# EAGLE design top (EAGLE 9.6.2)
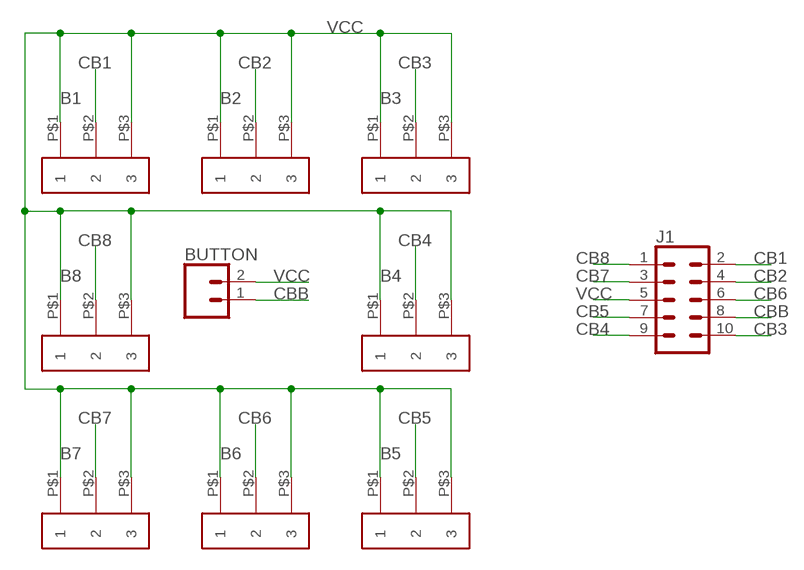
[diagram p0: schematic, sheet 1]

## Parts
B1  BOCAL  [BOCAL]
B2  BOCAL  [BOCAL]
B3  BOCAL  [BOCAL]
B4  BOCAL  [BOCAL]
B5  BOCAL  [BOCAL]
B6  BOCAL  [BOCAL]
B7  BOCAL  [BOCAL]
B8  BOCAL  [BOCAL]
BUTTON  CONN_02  [1X02]
J1  CONN_05X2NO_SILK  [2X5_NOSILK]

## Nets
CB1: B1.P$2 J1.2
CB2: B2.P$2 J1.4
CB3: B3.P$2 J1.10
CB4: B4.P$2 J1.9
CB5: B5.P$2 J1.7
CB6: B6.P$2 J1.6
CB7: B7.P$2 J1.3
CB8: B8.P$2 J1.1
CBB: BUTTON.1 J1.8
VCC: B1.P$1 B1.P$3 B2.P$1 B2.P$3 B3.P$1 B3.P$3 B4.P$1 B4.P$3 B5.P$1 B5.P$3 B6.P$1 B6.P$3 B7.P$1 B7.P$3 B8.P$1 B8.P$3 BUTTON.2 J1.5

## Library data of the parts
B1-B8 = myLib:BOCAL: Defines a base connector for Tampi.
BUTTON = SparkFun-Connectors:CONN_02: Multi connection point. Often used as Generic Header-pin footprint for 0.1 inch spaced/style header connections On any of the 0.1 inch spaced packages, you can populate with these: Break Away Headers - Straight <https://www.sparkfun.com/products/116> (PRT-00116) Break Away Male Headers - Right Angle <https://www.sparkfun.com/products/553> (PRT-00553) Female Headers <https://www.sparkfun.com/products/115> (PRT-00115) Break Away Headers - Machine Pin <https://www.sparkfun.com/products/117> (PRT-00117) Break Away Female Headers - Swiss Machine Pin <https://www.sparkfun.com/products/743> (PRT-00743) For SCREWTERMINALS and SPRING TERMINALS visit here: Screw Terimnals on SparkFun.com <https://www.sparkfun.com/search/results?term=Screw+Terminals> (5mm/3.5mm/2.54mm spacing) This device is also useful as a general connection point to wire up your design to another part of your project. Our various solder wires solder well into these plated through hole pads. Hook-Up Wire - Assortment (Stranded, 22 AWG) <https://www.sparkfun.com/products/11375> (PRT-11375) Hook-Up Wire - Assortment (Solid Core, 22 AWG) <https://www.sparkfun.com/products/11367> (PRT-11367) View the entire wire category on our website here <https://www.sparkfun.com/categories/141> Special notes: Molex polarized connector foot print use with: PRT-08233 with associated crimp pins and housings. 2.54_SCREWTERM for use with PRT-10571. 3.5mm Screw Terminal footprints for PRT-08084 5mm Screw Terminal footprints for use with PRT-08432
J1 = SparkFun-Connectors:CONN_05X2: Multi connection point. Often used as Generic Header-pin footprint for 0.1 inch spaced/style header connections For AVR SPI programming port, see special device with nice symbol: "AVR_SPI_PROG_5x2.dev" You can populate with any combo of single row headers, but if you'd like an exact match, check these: 2x5 AVR ICSP Male Header <https://www.sparkfun.com/products/778> (PRT-00778) 2x5 Pin Shrouded Header <https://www.sparkfun.com/products/8506> (PRT-08506) On any of the 0.1 inch spaced packages, you can populate with these: Break Away Headers - Straight <https://www.sparkfun.com/products/116> (PRT-00116) Break Away Male Headers - Right Angle <https://www.sparkfun.com/products/553> (PRT-00553) Female Headers <https://www.sparkfun.com/products/115> (PRT-00115) Break Away Headers - Machine Pin <https://www.sparkfun.com/products/117> (PRT-00117) Break Away Female Headers - Swiss Machine Pin <https://www.sparkfun.com/products/743> (PRT-00743) Special note: the shrouded connector mates well with our 5x2 ribbon cables: 2x5 Pin IDC Ribbon Cable <https://www.sparkfun.com/products/8535> (PRT-08535)

## Board
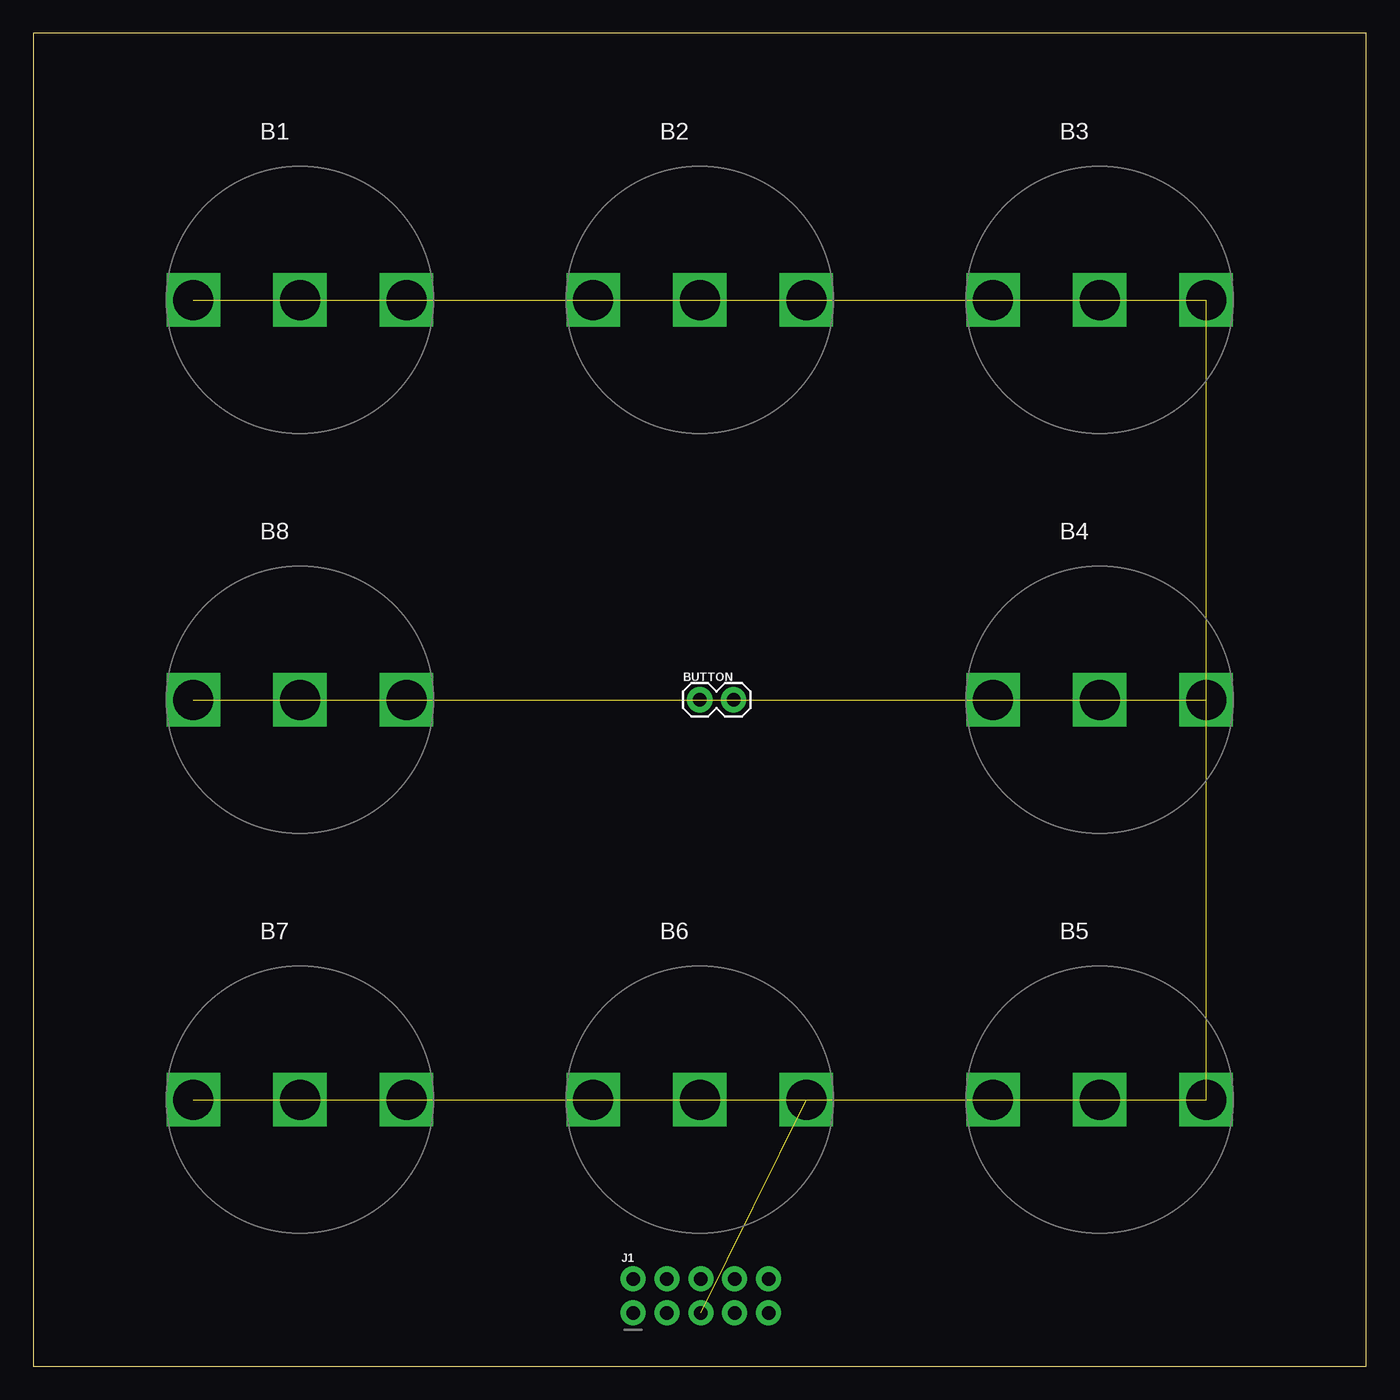
[diagram p1: board, top side]
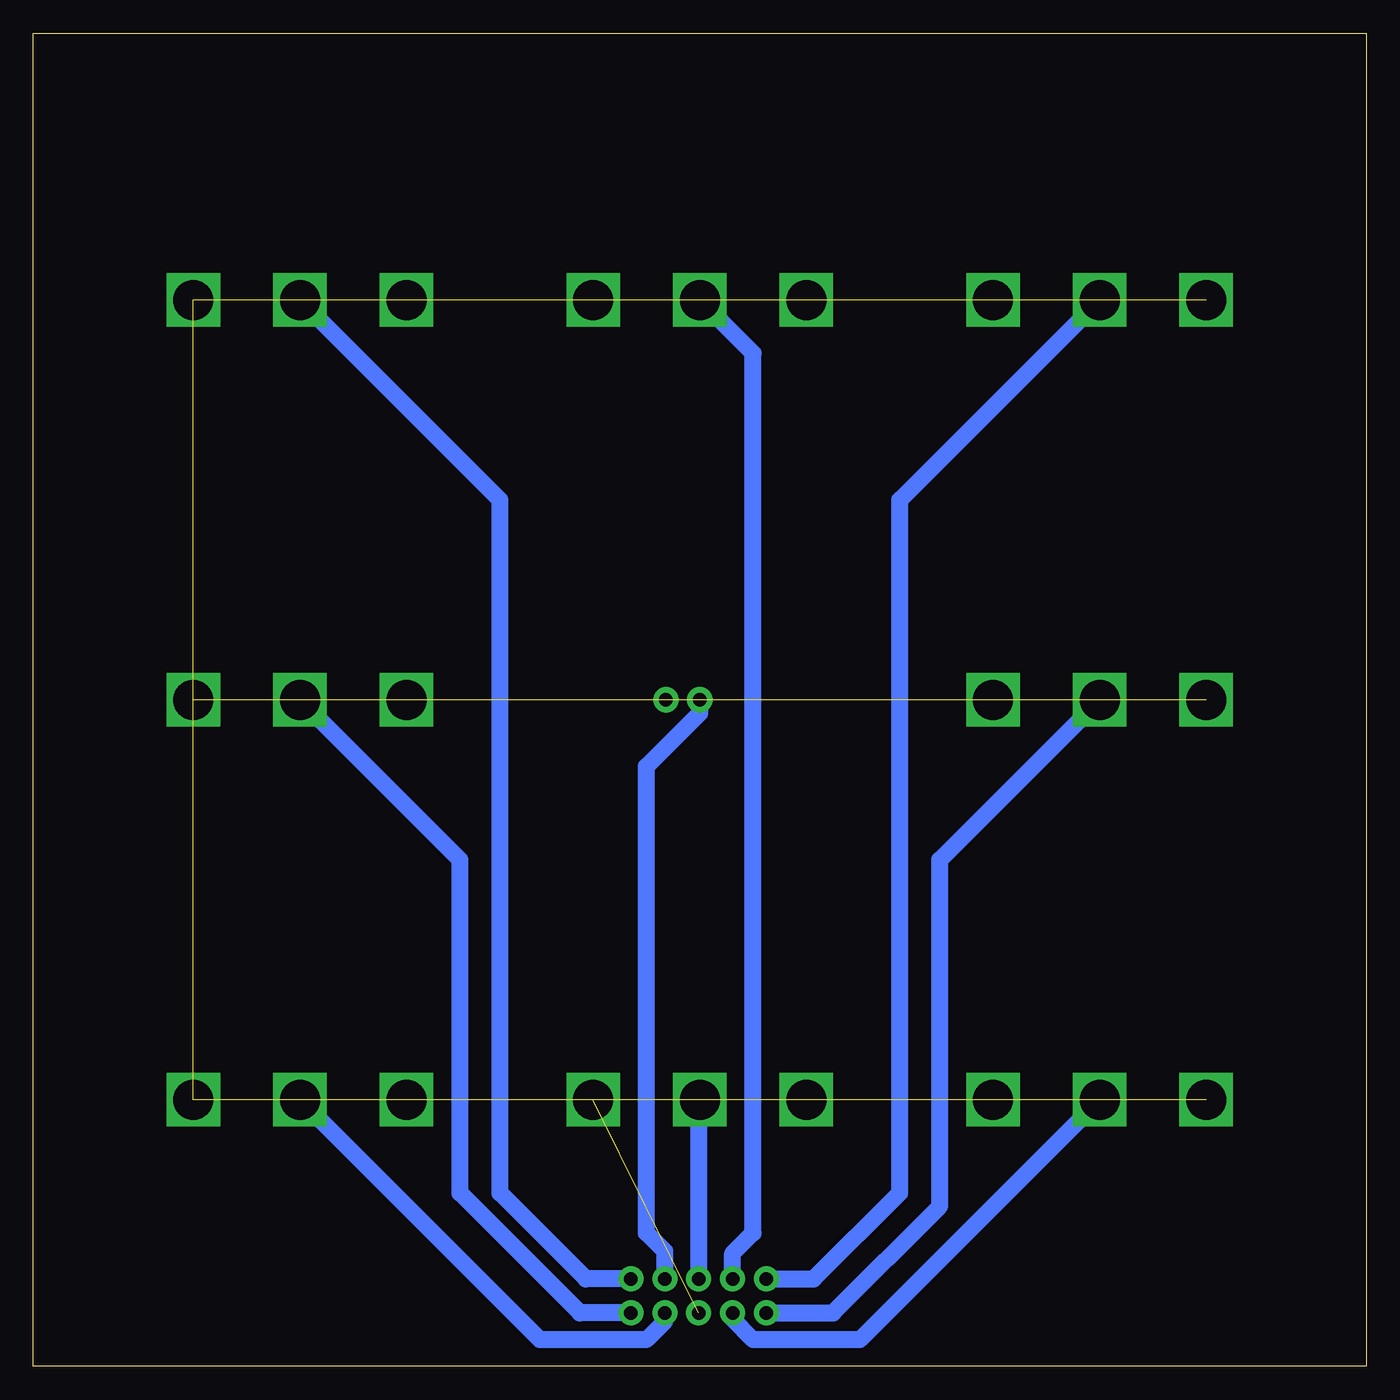
[diagram p2: board, bottom side, seen from below]

Size 100 x 100 mm. Coordinates in mm from the lower left corner, seen from the top.
Outline: 0,0 100,0 100,100 0,100 0,0
Copper layers (1*16): Top 0.035mm / dielectric 1.5mm / Bottom 0.035mm
Design rules "default": minimum track width 6mil, minimum drill 0.35mm, track to track 6mil, track to pad 6mil, pad to pad 6mil, via to via 6mil, smd to smd 6mil, copper to edge 40mil, drill to drill 6mil, minimum pad ring 10mil, minimum via ring 8mil, stop-mask expansion 4mil, vias tented up to drill 0mil, thermal gap 10mil

### Footprints (pad centres in the part's own frame; a part is rotated, then mirrored left to right if it is on the bottom)
BOCAL = drill 3 square: P$1 -8,0; P$2 0,0; P$3 8,0
1X02 = drill 1.016 pad 1.88: 1 0,0; 2 2.54,0
2X5_NOSILK = drill 1.016 pad 1.88: 1 0,0; 2 0,2.54; 3 2.54,0; 4 2.54,2.54; 5 5.08,0; 6 5.08,2.54; 7 7.62,0; 8 7.62,2.54; 9 10.16,0; 10 10.16,2.54

### Placement (x,y rotation side)
B1  20,80 0 top
B2  50,80 0 top
B3  80,80 0 top
B4  80,50 0 top
B5  80,20 0 top
B6  50,20 0 top
B7  20,20 0 top
B8  20,50 0 top
BUTTON  50,50 0 top
J1  45,4 0 top

### Tracks (layer width: path | path; a pad name or v marks a point on that pad's centre or on a via)
CB1
  Bottom 1.27: J1.2 41.46,6.54 35,13 35,65 B1.P$2
CB2
  Bottom 1.27: J1.4 47.54,8.46 46,10 46,76 B2.P$2
CB3
  Bottom 1.27: J1.10 58.54,6.54 65,13 65,65 B3.P$2
CB4
  Bottom 1.27: J1.9 59,4 68,13 68,38 B4.P$2
CB5
  Bottom 1.27: J1.7 52.62,3.38 54,2 62,2 B5.P$2
CB6
  Bottom 1.27: B6.P$2 50.08,19.92 J1.6
CB7
  Bottom 1.27: B7.P$2 38,2 46,2 47.54,3.54 J1.3
CB8
  Bottom 1.27: J1.1 40,4 32,12 32,38 B8.P$2
CBB
  Bottom 1.27: J1.8 52.62,8.62 54,10 54,45 50,49 BUTTON.1
VCC  (17 unrouted)